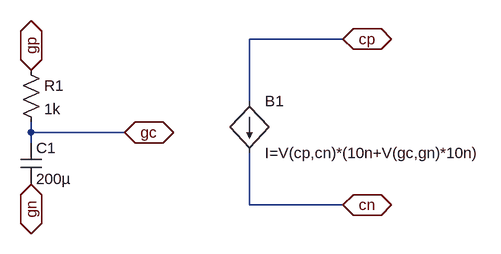
[diagram p0: schematic capteur.asc]
capteur.asc, the LTspice schematic file:
Version 4
SHEET 1 880 680
WIRE 464 48 320 48
WIRE 320 144 320 48
WIRE -16 192 -16 176
WIRE 128 192 -16 192
WIRE -16 208 -16 192
WIRE 320 304 320 224
WIRE 464 304 320 304
FLAG -16 96 gp
IOPIN -16 96 BiDir
FLAG -16 272 gn
IOPIN -16 272 BiDir
FLAG 128 192 gc
IOPIN 128 192 BiDir
FLAG 464 48 cp
IOPIN 464 48 BiDir
FLAG 464 304 cn
IOPIN 464 304 BiDir
SYMBOL res -32 80 R0
SYMATTR InstName R1
SYMATTR Value 1k
SYMBOL cap -32 208 R0
SYMATTR InstName C1
SYMATTR Value 200µ
SYMBOL bi 320 144 R0
SYMATTR InstName B1
SYMATTR Value I=V(cp,cn)*(10n+V(gc,gn)*10n)

The netlist it stands for:
* capteur.asc
R1 gp gc 1k
C1 gc gn 200µ
B1 cp cn I=V(cp,cn)*(10n+V(gc,gn)*10n)
.backanno
.end